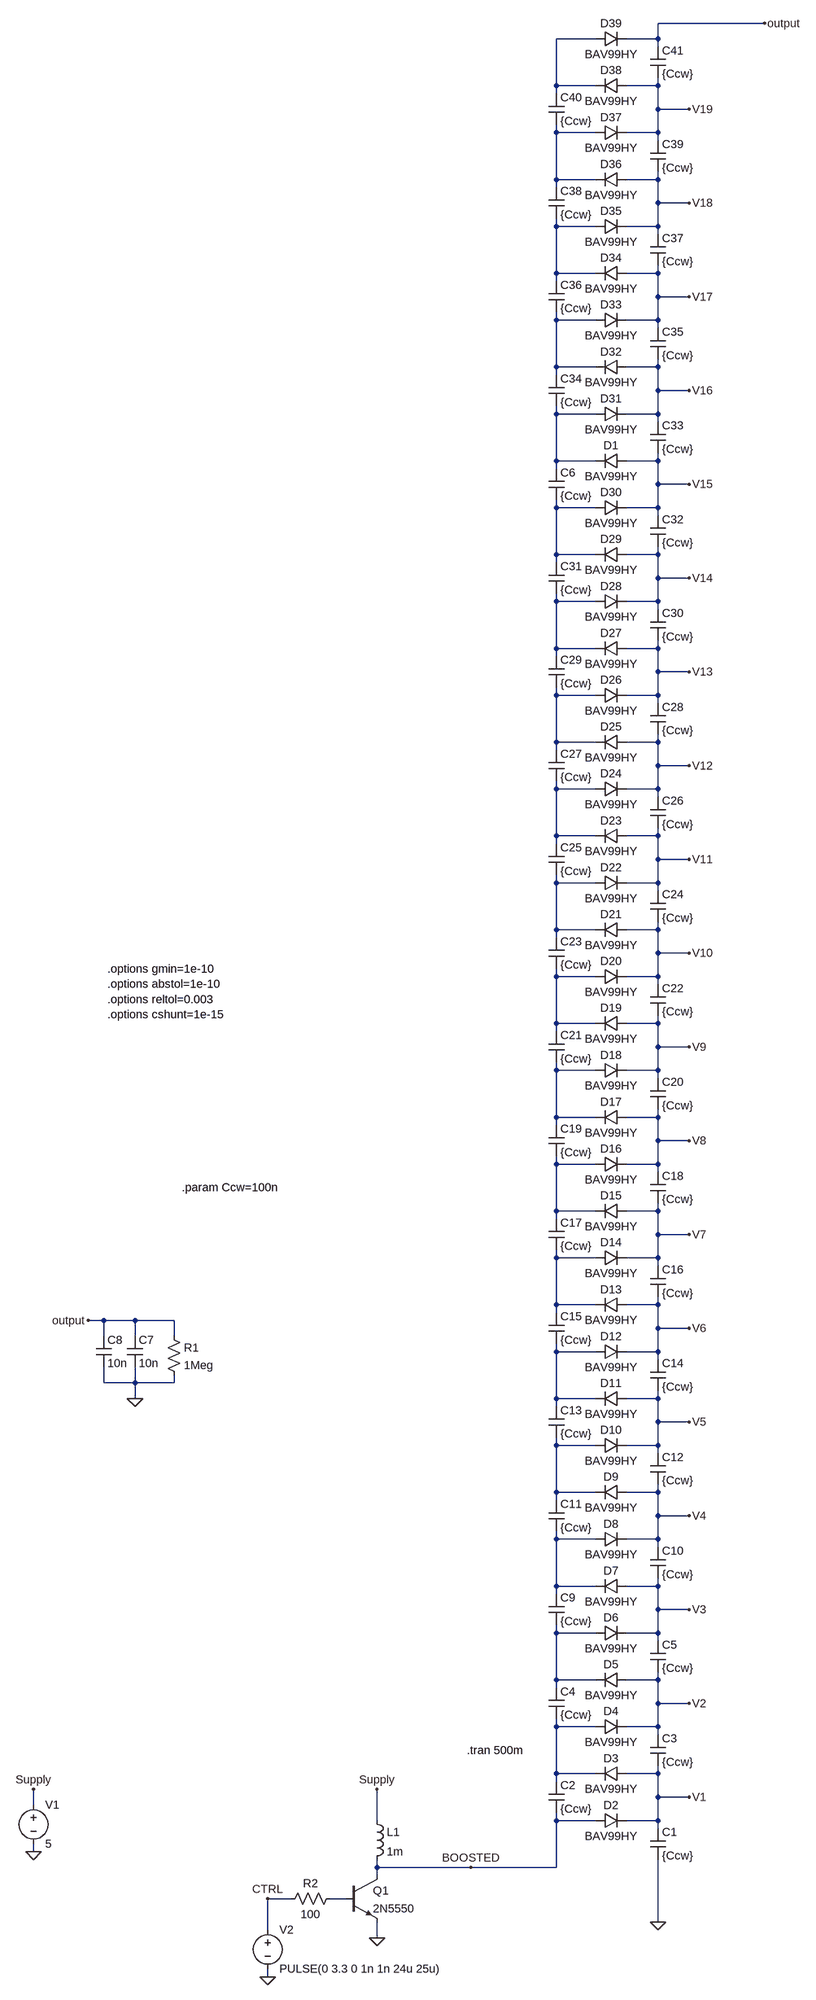
[diagram p0: schematic HVgeneration.asc]
HVgeneration.asc, the LTspice schematic file:
Version 4
SHEET 1 880 680
WIRE 432 -4096 192 -4096
WIRE 64 -4064 -16 -4064
WIRE 192 -4064 192 -4096
WIRE 192 -4064 128 -4064
WIRE 192 -4048 192 -4064
WIRE -16 -3968 -16 -4064
WIRE 64 -3968 -16 -3968
WIRE 192 -3968 192 -3984
WIRE 192 -3968 128 -3968
WIRE -16 -3952 -16 -3968
WIRE 192 -3920 192 -3968
WIRE 256 -3920 192 -3920
WIRE -16 -3872 -16 -3888
WIRE 64 -3872 -16 -3872
WIRE 192 -3872 192 -3920
WIRE 192 -3872 128 -3872
WIRE 192 -3856 192 -3872
WIRE -16 -3776 -16 -3872
WIRE 64 -3776 -16 -3776
WIRE 192 -3776 192 -3792
WIRE 192 -3776 128 -3776
WIRE -16 -3760 -16 -3776
WIRE 192 -3728 192 -3776
WIRE 256 -3728 192 -3728
WIRE -16 -3680 -16 -3696
WIRE 64 -3680 -16 -3680
WIRE 192 -3680 192 -3728
WIRE 192 -3680 128 -3680
WIRE 192 -3664 192 -3680
WIRE -16 -3584 -16 -3680
WIRE 64 -3584 -16 -3584
WIRE 192 -3584 192 -3600
WIRE 192 -3584 128 -3584
WIRE -16 -3568 -16 -3584
WIRE 192 -3536 192 -3584
WIRE 256 -3536 192 -3536
WIRE -16 -3488 -16 -3504
WIRE 64 -3488 -16 -3488
WIRE 192 -3488 192 -3536
WIRE 192 -3488 128 -3488
WIRE 192 -3472 192 -3488
WIRE -16 -3392 -16 -3488
WIRE 64 -3392 -16 -3392
WIRE 192 -3392 192 -3408
WIRE 192 -3392 128 -3392
WIRE -16 -3376 -16 -3392
WIRE 192 -3344 192 -3392
WIRE 256 -3344 192 -3344
WIRE -16 -3296 -16 -3312
WIRE 64 -3296 -16 -3296
WIRE 192 -3296 192 -3344
WIRE 192 -3296 128 -3296
WIRE 192 -3280 192 -3296
WIRE -16 -3200 -16 -3296
WIRE 64 -3200 -16 -3200
WIRE 192 -3200 192 -3216
WIRE 192 -3200 128 -3200
WIRE -16 -3184 -16 -3200
WIRE 192 -3152 192 -3200
WIRE 256 -3152 192 -3152
WIRE -16 -3104 -16 -3120
WIRE 64 -3104 -16 -3104
WIRE 192 -3104 192 -3152
WIRE 192 -3104 128 -3104
WIRE 192 -3088 192 -3104
WIRE -16 -3008 -16 -3104
WIRE 64 -3008 -16 -3008
WIRE 192 -3008 192 -3024
WIRE 192 -3008 128 -3008
WIRE -16 -2992 -16 -3008
WIRE 192 -2960 192 -3008
WIRE 256 -2960 192 -2960
WIRE -16 -2912 -16 -2928
WIRE 64 -2912 -16 -2912
WIRE 192 -2912 192 -2960
WIRE 192 -2912 128 -2912
WIRE 192 -2896 192 -2912
WIRE -16 -2816 -16 -2912
WIRE 64 -2816 -16 -2816
WIRE 192 -2816 192 -2832
WIRE 192 -2816 128 -2816
WIRE -16 -2800 -16 -2816
WIRE 192 -2768 192 -2816
WIRE 256 -2768 192 -2768
WIRE -16 -2720 -16 -2736
WIRE 64 -2720 -16 -2720
WIRE 192 -2720 192 -2768
WIRE 192 -2720 128 -2720
WIRE 192 -2704 192 -2720
WIRE -16 -2624 -16 -2720
WIRE 64 -2624 -16 -2624
WIRE 192 -2624 192 -2640
WIRE 192 -2624 128 -2624
WIRE -16 -2608 -16 -2624
WIRE 192 -2576 192 -2624
WIRE 256 -2576 192 -2576
WIRE -16 -2528 -16 -2544
WIRE 64 -2528 -16 -2528
WIRE 192 -2528 192 -2576
WIRE 192 -2528 128 -2528
WIRE 192 -2512 192 -2528
WIRE -16 -2432 -16 -2528
WIRE 64 -2432 -16 -2432
WIRE 192 -2432 192 -2448
WIRE 192 -2432 128 -2432
WIRE -16 -2416 -16 -2432
WIRE 192 -2384 192 -2432
WIRE 256 -2384 192 -2384
WIRE -16 -2336 -16 -2352
WIRE 64 -2336 -16 -2336
WIRE 192 -2336 192 -2384
WIRE 192 -2336 128 -2336
WIRE 192 -2320 192 -2336
WIRE -16 -2240 -16 -2336
WIRE 64 -2240 -16 -2240
WIRE 192 -2240 192 -2256
WIRE 192 -2240 128 -2240
WIRE -16 -2224 -16 -2240
WIRE 192 -2192 192 -2240
WIRE 256 -2192 192 -2192
WIRE -16 -2144 -16 -2160
WIRE 64 -2144 -16 -2144
WIRE 192 -2144 192 -2192
WIRE 192 -2144 128 -2144
WIRE 192 -2128 192 -2144
WIRE -16 -2048 -16 -2144
WIRE 64 -2048 -16 -2048
WIRE 192 -2048 192 -2064
WIRE 192 -2048 128 -2048
WIRE -16 -2032 -16 -2048
WIRE 192 -2000 192 -2048
WIRE 256 -2000 192 -2000
WIRE -16 -1952 -16 -1968
WIRE 64 -1952 -16 -1952
WIRE 192 -1952 192 -2000
WIRE 192 -1952 128 -1952
WIRE 192 -1936 192 -1952
WIRE -16 -1856 -16 -1952
WIRE 64 -1856 -16 -1856
WIRE 192 -1856 192 -1872
WIRE 192 -1856 128 -1856
WIRE -16 -1840 -16 -1856
WIRE 192 -1808 192 -1856
WIRE 256 -1808 192 -1808
WIRE -16 -1760 -16 -1776
WIRE 64 -1760 -16 -1760
WIRE 192 -1760 192 -1808
WIRE 192 -1760 128 -1760
WIRE 192 -1744 192 -1760
WIRE -16 -1664 -16 -1760
WIRE 64 -1664 -16 -1664
WIRE 192 -1664 192 -1680
WIRE 192 -1664 128 -1664
WIRE -16 -1648 -16 -1664
WIRE 192 -1616 192 -1664
WIRE 256 -1616 192 -1616
WIRE -16 -1568 -16 -1584
WIRE 64 -1568 -16 -1568
WIRE 192 -1568 192 -1616
WIRE 192 -1568 128 -1568
WIRE 192 -1552 192 -1568
WIRE -16 -1472 -16 -1568
WIRE 64 -1472 -16 -1472
WIRE 192 -1472 192 -1488
WIRE 192 -1472 128 -1472
WIRE -16 -1456 -16 -1472
WIRE -944 -1440 -976 -1440
WIRE -880 -1440 -944 -1440
WIRE -800 -1440 -880 -1440
WIRE 192 -1424 192 -1472
WIRE 256 -1424 192 -1424
WIRE -944 -1408 -944 -1440
WIRE -880 -1408 -880 -1440
WIRE -800 -1408 -800 -1440
WIRE -16 -1376 -16 -1392
WIRE 64 -1376 -16 -1376
WIRE 192 -1376 192 -1424
WIRE 192 -1376 128 -1376
WIRE 192 -1360 192 -1376
WIRE -944 -1312 -944 -1344
WIRE -880 -1312 -880 -1344
WIRE -880 -1312 -944 -1312
WIRE -800 -1312 -800 -1328
WIRE -800 -1312 -880 -1312
WIRE -880 -1280 -880 -1312
WIRE -16 -1280 -16 -1376
WIRE 64 -1280 -16 -1280
WIRE 192 -1280 192 -1296
WIRE 192 -1280 128 -1280
WIRE -16 -1264 -16 -1280
WIRE 192 -1232 192 -1280
WIRE 256 -1232 192 -1232
WIRE -16 -1184 -16 -1200
WIRE 64 -1184 -16 -1184
WIRE 192 -1184 192 -1232
WIRE 192 -1184 128 -1184
WIRE 192 -1168 192 -1184
WIRE -16 -1088 -16 -1184
WIRE 64 -1088 -16 -1088
WIRE 192 -1088 192 -1104
WIRE 192 -1088 128 -1088
WIRE -16 -1072 -16 -1088
WIRE 192 -1040 192 -1088
WIRE 256 -1040 192 -1040
WIRE -16 -992 -16 -1008
WIRE 64 -992 -16 -992
WIRE 192 -992 192 -1040
WIRE 192 -992 128 -992
WIRE 192 -976 192 -992
WIRE -16 -896 -16 -992
WIRE 64 -896 -16 -896
WIRE 192 -896 192 -912
WIRE 192 -896 128 -896
WIRE -16 -880 -16 -896
WIRE 192 -848 192 -896
WIRE 256 -848 192 -848
WIRE -16 -800 -16 -816
WIRE 64 -800 -16 -800
WIRE 192 -800 192 -848
WIRE 192 -800 128 -800
WIRE 192 -784 192 -800
WIRE -16 -704 -16 -800
WIRE 64 -704 -16 -704
WIRE 192 -704 192 -720
WIRE 192 -704 128 -704
WIRE -16 -688 -16 -704
WIRE 192 -656 192 -704
WIRE 256 -656 192 -656
WIRE -16 -608 -16 -624
WIRE 64 -608 -16 -608
WIRE 192 -608 192 -656
WIRE 192 -608 128 -608
WIRE 192 -592 192 -608
WIRE -16 -512 -16 -608
WIRE 64 -512 -16 -512
WIRE 192 -512 192 -528
WIRE 192 -512 128 -512
WIRE -16 -496 -16 -512
WIRE 192 -464 192 -512
WIRE 256 -464 192 -464
WIRE -1088 -448 -1088 -480
WIRE -384 -416 -384 -480
WIRE -16 -416 -16 -432
WIRE 64 -416 -16 -416
WIRE 192 -416 192 -464
WIRE 192 -416 128 -416
WIRE 192 -400 192 -416
WIRE -1088 -352 -1088 -368
WIRE -384 -320 -384 -336
WIRE -192 -320 -384 -320
WIRE -16 -320 -16 -416
WIRE -16 -320 -192 -320
WIRE -384 -304 -384 -320
WIRE -560 -256 -608 -256
WIRE -448 -256 -480 -256
WIRE 192 -208 192 -336
WIRE -608 -192 -608 -256
WIRE -384 -176 -384 -208
WIRE -608 -96 -608 -112
FLAG 192 -208 0
FLAG -608 -96 0
FLAG 256 -464 V1
FLAG 256 -656 V2
FLAG -880 -1280 0
FLAG 256 -848 V3
FLAG 256 -1040 V4
FLAG 256 -1232 V5
FLAG 256 -1424 V6
FLAG 256 -1616 V7
FLAG -976 -1440 output
FLAG 256 -1808 V8
FLAG 256 -2000 V9
FLAG 256 -2192 V10
FLAG 256 -2384 V11
FLAG 256 -2576 V12
FLAG 256 -2768 V13
FLAG 256 -2960 V14
FLAG -1088 -352 0
FLAG -1088 -480 Supply
FLAG -384 -480 Supply
FLAG -384 -176 0
FLAG -608 -256 CTRL
FLAG -192 -320 BOOSTED
FLAG 256 -3152 V15
FLAG 256 -3344 V16
FLAG 256 -3536 V17
FLAG 256 -3728 V18
FLAG 256 -3920 V19
FLAG 432 -4096 output
SYMBOL diode 64 -400 R270
WINDOW 0 32 32 VTop 2
WINDOW 3 0 32 VBottom 2
SYMATTR InstName D2
SYMATTR Value BAV99HY
SYMBOL cap 176 -400 R0
SYMATTR InstName C1
SYMATTR Value {Ccw}
SYMBOL diode 128 -528 R90
WINDOW 0 0 32 VBottom 2
WINDOW 3 32 32 VTop 2
SYMATTR InstName D3
SYMATTR Value BAV99HY
SYMBOL diode 64 -592 R270
WINDOW 0 32 32 VTop 2
WINDOW 3 0 32 VBottom 2
SYMATTR InstName D4
SYMATTR Value BAV99HY
SYMBOL diode 128 -720 R90
WINDOW 0 0 32 VBottom 2
WINDOW 3 32 32 VTop 2
SYMATTR InstName D5
SYMATTR Value BAV99HY
SYMBOL diode 64 -784 R270
WINDOW 0 32 32 VTop 2
WINDOW 3 0 32 VBottom 2
SYMATTR InstName D6
SYMATTR Value BAV99HY
SYMBOL cap -32 -496 R0
SYMATTR InstName C2
SYMATTR Value {Ccw}
SYMBOL cap 176 -592 R0
SYMATTR InstName C3
SYMATTR Value {Ccw}
SYMBOL cap -32 -688 R0
SYMATTR InstName C4
SYMATTR Value {Ccw}
SYMBOL cap 176 -784 R0
SYMATTR InstName C5
SYMATTR Value {Ccw}
SYMBOL voltage -608 -208 R0
WINDOW 123 0 0 Left 0
WINDOW 39 0 0 Left 0
SYMATTR InstName V2
SYMATTR Value PULSE(0 3.3 0 1n 1n 24u 25u)
SYMBOL cap -896 -1408 R0
SYMATTR InstName C7
SYMATTR Value 10n
SYMBOL res -816 -1424 R0
SYMATTR InstName R1
SYMATTR Value 1Meg
SYMBOL cap -960 -1408 R0
SYMATTR InstName C8
SYMATTR Value 10n
SYMBOL diode 128 -912 R90
WINDOW 0 0 32 VBottom 2
WINDOW 3 32 32 VTop 2
SYMATTR InstName D7
SYMATTR Value BAV99HY
SYMBOL diode 64 -976 R270
WINDOW 0 32 32 VTop 2
WINDOW 3 0 32 VBottom 2
SYMATTR InstName D8
SYMATTR Value BAV99HY
SYMBOL cap -32 -880 R0
SYMATTR InstName C9
SYMATTR Value {Ccw}
SYMBOL cap 176 -976 R0
SYMATTR InstName C10
SYMATTR Value {Ccw}
SYMBOL diode 128 -1104 R90
WINDOW 0 0 32 VBottom 2
WINDOW 3 32 32 VTop 2
SYMATTR InstName D9
SYMATTR Value BAV99HY
SYMBOL diode 64 -1168 R270
WINDOW 0 32 32 VTop 2
WINDOW 3 0 32 VBottom 2
SYMATTR InstName D10
SYMATTR Value BAV99HY
SYMBOL cap -32 -1072 R0
SYMATTR InstName C11
SYMATTR Value {Ccw}
SYMBOL cap 176 -1168 R0
SYMATTR InstName C12
SYMATTR Value {Ccw}
SYMBOL diode 128 -1296 R90
WINDOW 0 0 32 VBottom 2
WINDOW 3 32 32 VTop 2
SYMATTR InstName D11
SYMATTR Value BAV99HY
SYMBOL diode 64 -1360 R270
WINDOW 0 32 32 VTop 2
WINDOW 3 0 32 VBottom 2
SYMATTR InstName D12
SYMATTR Value BAV99HY
SYMBOL cap -32 -1264 R0
SYMATTR InstName C13
SYMATTR Value {Ccw}
SYMBOL cap 176 -1360 R0
SYMATTR InstName C14
SYMATTR Value {Ccw}
SYMBOL diode 128 -1488 R90
WINDOW 0 0 32 VBottom 2
WINDOW 3 32 32 VTop 2
SYMATTR InstName D13
SYMATTR Value BAV99HY
SYMBOL diode 64 -1552 R270
WINDOW 0 32 32 VTop 2
WINDOW 3 0 32 VBottom 2
SYMATTR InstName D14
SYMATTR Value BAV99HY
SYMBOL cap -32 -1456 R0
SYMATTR InstName C15
SYMATTR Value {Ccw}
SYMBOL cap 176 -1552 R0
SYMATTR InstName C16
SYMATTR Value {Ccw}
SYMBOL diode 128 -1680 R90
WINDOW 0 0 32 VBottom 2
WINDOW 3 32 32 VTop 2
SYMATTR InstName D15
SYMATTR Value BAV99HY
SYMBOL diode 64 -1744 R270
WINDOW 0 32 32 VTop 2
WINDOW 3 0 32 VBottom 2
SYMATTR InstName D16
SYMATTR Value BAV99HY
SYMBOL cap -32 -1648 R0
SYMATTR InstName C17
SYMATTR Value {Ccw}
SYMBOL cap 176 -1744 R0
SYMATTR InstName C18
SYMATTR Value {Ccw}
SYMBOL diode 128 -1872 R90
WINDOW 0 0 32 VBottom 2
WINDOW 3 32 32 VTop 2
SYMATTR InstName D17
SYMATTR Value BAV99HY
SYMBOL diode 64 -1936 R270
WINDOW 0 32 32 VTop 2
WINDOW 3 0 32 VBottom 2
SYMATTR InstName D18
SYMATTR Value BAV99HY
SYMBOL diode 128 -2064 R90
WINDOW 0 0 32 VBottom 2
WINDOW 3 32 32 VTop 2
SYMATTR InstName D19
SYMATTR Value BAV99HY
SYMBOL diode 64 -2128 R270
WINDOW 0 32 32 VTop 2
WINDOW 3 0 32 VBottom 2
SYMATTR InstName D20
SYMATTR Value BAV99HY
SYMBOL cap -32 -1840 R0
SYMATTR InstName C19
SYMATTR Value {Ccw}
SYMBOL cap 176 -1936 R0
SYMATTR InstName C20
SYMATTR Value {Ccw}
SYMBOL cap -32 -2032 R0
SYMATTR InstName C21
SYMATTR Value {Ccw}
SYMBOL cap 176 -2128 R0
SYMATTR InstName C22
SYMATTR Value {Ccw}
SYMBOL diode 128 -2256 R90
WINDOW 0 0 32 VBottom 2
WINDOW 3 32 32 VTop 2
SYMATTR InstName D21
SYMATTR Value BAV99HY
SYMBOL diode 64 -2320 R270
WINDOW 0 32 32 VTop 2
WINDOW 3 0 32 VBottom 2
SYMATTR InstName D22
SYMATTR Value BAV99HY
SYMBOL cap -32 -2224 R0
SYMATTR InstName C23
SYMATTR Value {Ccw}
SYMBOL cap 176 -2320 R0
SYMATTR InstName C24
SYMATTR Value {Ccw}
SYMBOL diode 128 -2448 R90
WINDOW 0 0 32 VBottom 2
WINDOW 3 32 32 VTop 2
SYMATTR InstName D23
SYMATTR Value BAV99HY
SYMBOL diode 64 -2512 R270
WINDOW 0 32 32 VTop 2
WINDOW 3 0 32 VBottom 2
SYMATTR InstName D24
SYMATTR Value BAV99HY
SYMBOL cap -32 -2416 R0
SYMATTR InstName C25
SYMATTR Value {Ccw}
SYMBOL cap 176 -2512 R0
SYMATTR InstName C26
SYMATTR Value {Ccw}
SYMBOL diode 128 -2640 R90
WINDOW 0 0 32 VBottom 2
WINDOW 3 32 32 VTop 2
SYMATTR InstName D25
SYMATTR Value BAV99HY
SYMBOL diode 64 -2704 R270
WINDOW 0 32 32 VTop 2
WINDOW 3 0 32 VBottom 2
SYMATTR InstName D26
SYMATTR Value BAV99HY
SYMBOL cap -32 -2608 R0
SYMATTR InstName C27
SYMATTR Value {Ccw}
SYMBOL cap 176 -2704 R0
SYMATTR InstName C28
SYMATTR Value {Ccw}
SYMBOL diode 128 -2832 R90
WINDOW 0 0 32 VBottom 2
WINDOW 3 32 32 VTop 2
SYMATTR InstName D27
SYMATTR Value BAV99HY
SYMBOL diode 64 -2896 R270
WINDOW 0 32 32 VTop 2
WINDOW 3 0 32 VBottom 2
SYMATTR InstName D28
SYMATTR Value BAV99HY
SYMBOL cap -32 -2800 R0
SYMATTR InstName C29
SYMATTR Value {Ccw}
SYMBOL cap 176 -2896 R0
SYMATTR InstName C30
SYMATTR Value {Ccw}
SYMBOL diode 128 -3024 R90
WINDOW 0 0 32 VBottom 2
WINDOW 3 32 32 VTop 2
SYMATTR InstName D29
SYMATTR Value BAV99HY
SYMBOL diode 64 -3088 R270
WINDOW 0 32 32 VTop 2
WINDOW 3 0 32 VBottom 2
SYMATTR InstName D30
SYMATTR Value BAV99HY
SYMBOL cap -32 -2992 R0
SYMATTR InstName C31
SYMATTR Value {Ccw}
SYMBOL cap 176 -3088 R0
SYMATTR InstName C32
SYMATTR Value {Ccw}
SYMBOL ind -400 -432 R0
SYMATTR InstName L1
SYMATTR Value 1m
SYMBOL voltage -1088 -464 R0
WINDOW 123 0 0 Left 0
WINDOW 39 0 0 Left 0
SYMATTR InstName V1
SYMATTR Value 5
SYMBOL res -464 -272 R90
WINDOW 0 0 56 VBottom 2
WINDOW 3 32 56 VTop 2
SYMATTR InstName R2
SYMATTR Value 100
SYMBOL npn -448 -304 R0
SYMATTR InstName Q1
SYMATTR Value 2N5550
SYMBOL diode 128 -3216 R90
WINDOW 0 0 32 VBottom 2
WINDOW 3 32 32 VTop 2
SYMATTR InstName D1
SYMATTR Value BAV99HY
SYMBOL diode 64 -3280 R270
WINDOW 0 32 32 VTop 2
WINDOW 3 0 32 VBottom 2
SYMATTR InstName D31
SYMATTR Value BAV99HY
SYMBOL cap -32 -3184 R0
SYMATTR InstName C6
SYMATTR Value {Ccw}
SYMBOL cap 176 -3280 R0
SYMATTR InstName C33
SYMATTR Value {Ccw}
SYMBOL diode 128 -3408 R90
WINDOW 0 0 32 VBottom 2
WINDOW 3 32 32 VTop 2
SYMATTR InstName D32
SYMATTR Value BAV99HY
SYMBOL diode 64 -3472 R270
WINDOW 0 32 32 VTop 2
WINDOW 3 0 32 VBottom 2
SYMATTR InstName D33
SYMATTR Value BAV99HY
SYMBOL cap -32 -3376 R0
SYMATTR InstName C34
SYMATTR Value {Ccw}
SYMBOL cap 176 -3472 R0
SYMATTR InstName C35
SYMATTR Value {Ccw}
SYMBOL diode 128 -3600 R90
WINDOW 0 0 32 VBottom 2
WINDOW 3 32 32 VTop 2
SYMATTR InstName D34
SYMATTR Value BAV99HY
SYMBOL diode 64 -3664 R270
WINDOW 0 32 32 VTop 2
WINDOW 3 0 32 VBottom 2
SYMATTR InstName D35
SYMATTR Value BAV99HY
SYMBOL cap -32 -3568 R0
SYMATTR InstName C36
SYMATTR Value {Ccw}
SYMBOL cap 176 -3664 R0
SYMATTR InstName C37
SYMATTR Value {Ccw}
SYMBOL diode 128 -3792 R90
WINDOW 0 0 32 VBottom 2
WINDOW 3 32 32 VTop 2
SYMATTR InstName D36
SYMATTR Value BAV99HY
SYMBOL diode 64 -3856 R270
WINDOW 0 32 32 VTop 2
WINDOW 3 0 32 VBottom 2
SYMATTR InstName D37
SYMATTR Value BAV99HY
SYMBOL cap -32 -3760 R0
SYMATTR InstName C38
SYMATTR Value {Ccw}
SYMBOL cap 176 -3856 R0
SYMATTR InstName C39
SYMATTR Value {Ccw}
SYMBOL diode 128 -3984 R90
WINDOW 0 0 32 VBottom 2
WINDOW 3 32 32 VTop 2
SYMATTR InstName D38
SYMATTR Value BAV99HY
SYMBOL diode 64 -4048 R270
WINDOW 0 32 32 VTop 2
WINDOW 3 0 32 VBottom 2
SYMATTR InstName D39
SYMATTR Value BAV99HY
SYMBOL cap -32 -3952 R0
SYMATTR InstName C40
SYMATTR Value {Ccw}
SYMBOL cap 176 -4048 R0
SYMATTR InstName C41
SYMATTR Value {Ccw}
TEXT -200 -560 Left 2 !.tran 500m
TEXT -784 -1712 Left 2 !.param Ccw=100n
TEXT -936 -2160 Left 2 !.options gmin=1e-10\n.options abstol=1e-10\n.options reltol=0.003\n.options cshunt=1e-15

The netlist it stands for:
* HVgeneration.asc
D2 BOOSTED V1 BAV99HY
C1 V1 0 {Ccw}
D3 V1 N019 BAV99HY
D4 N019 V2 BAV99HY
D5 V2 N018 BAV99HY
D6 N018 V3 BAV99HY
C2 N019 BOOSTED {Ccw}
C3 V2 V1 {Ccw}
C4 N018 N019 {Ccw}
C5 V3 V2 {Ccw}
V2 CTRL 0 PULSE(0 3.3 0 1n 1n 24u 25u)
C7 output 0 10n
R1 output 0 1Meg
C8 output 0 10n
D7 V3 N017 BAV99HY
D8 N017 V4 BAV99HY
C9 N017 N018 {Ccw}
C10 V4 V3 {Ccw}
D9 V4 N016 BAV99HY
D10 N016 V5 BAV99HY
C11 N016 N017 {Ccw}
C12 V5 V4 {Ccw}
D11 V5 N015 BAV99HY
D12 N015 V6 BAV99HY
C13 N015 N016 {Ccw}
C14 V6 V5 {Ccw}
D13 V6 N014 BAV99HY
D14 N014 V7 BAV99HY
C15 N014 N015 {Ccw}
C16 V7 V6 {Ccw}
D15 V7 N013 BAV99HY
D16 N013 V8 BAV99HY
C17 N013 N014 {Ccw}
C18 V8 V7 {Ccw}
D17 V8 N012 BAV99HY
D18 N012 V9 BAV99HY
D19 V9 N011 BAV99HY
D20 N011 V10 BAV99HY
C19 N012 N013 {Ccw}
C20 V9 V8 {Ccw}
C21 N011 N012 {Ccw}
C22 V10 V9 {Ccw}
D21 V10 N010 BAV99HY
D22 N010 V11 BAV99HY
C23 N010 N011 {Ccw}
C24 V11 V10 {Ccw}
D23 V11 N009 BAV99HY
D24 N009 V12 BAV99HY
C25 N009 N010 {Ccw}
C26 V12 V11 {Ccw}
D25 V12 N008 BAV99HY
D26 N008 V13 BAV99HY
C27 N008 N009 {Ccw}
C28 V13 V12 {Ccw}
D27 V13 N007 BAV99HY
D28 N007 V14 BAV99HY
C29 N007 N008 {Ccw}
C30 V14 V13 {Ccw}
D29 V14 N006 BAV99HY
D30 N006 V15 BAV99HY
C31 N006 N007 {Ccw}
C32 V15 V14 {Ccw}
L1 Supply BOOSTED 1m
V1 Supply 0 5
R2 N020 CTRL 100
Q1 BOOSTED N020 0 0 2N5550
D1 V15 N005 BAV99HY
D31 N005 V16 BAV99HY
C6 N005 N006 {Ccw}
C33 V16 V15 {Ccw}
D32 V16 N004 BAV99HY
D33 N004 V17 BAV99HY
C34 N004 N005 {Ccw}
C35 V17 V16 {Ccw}
D34 V17 N003 BAV99HY
D35 N003 V18 BAV99HY
C36 N003 N004 {Ccw}
C37 V18 V17 {Ccw}
D36 V18 N002 BAV99HY
D37 N002 V19 BAV99HY
C38 N002 N003 {Ccw}
C39 V19 V18 {Ccw}
D38 V19 N001 BAV99HY
D39 N001 output BAV99HY
C40 N001 N002 {Ccw}
C41 output V19 {Ccw}
.model D D
.lib standard.dio
.model NPN NPN
.model PNP PNP
.lib standard.bjt
.tran 500m
.param Ccw=100n
.options gmin=1e-10
.options abstol=1e-10
.options reltol=0.003
.options cshunt=1e-15
.backanno
.end